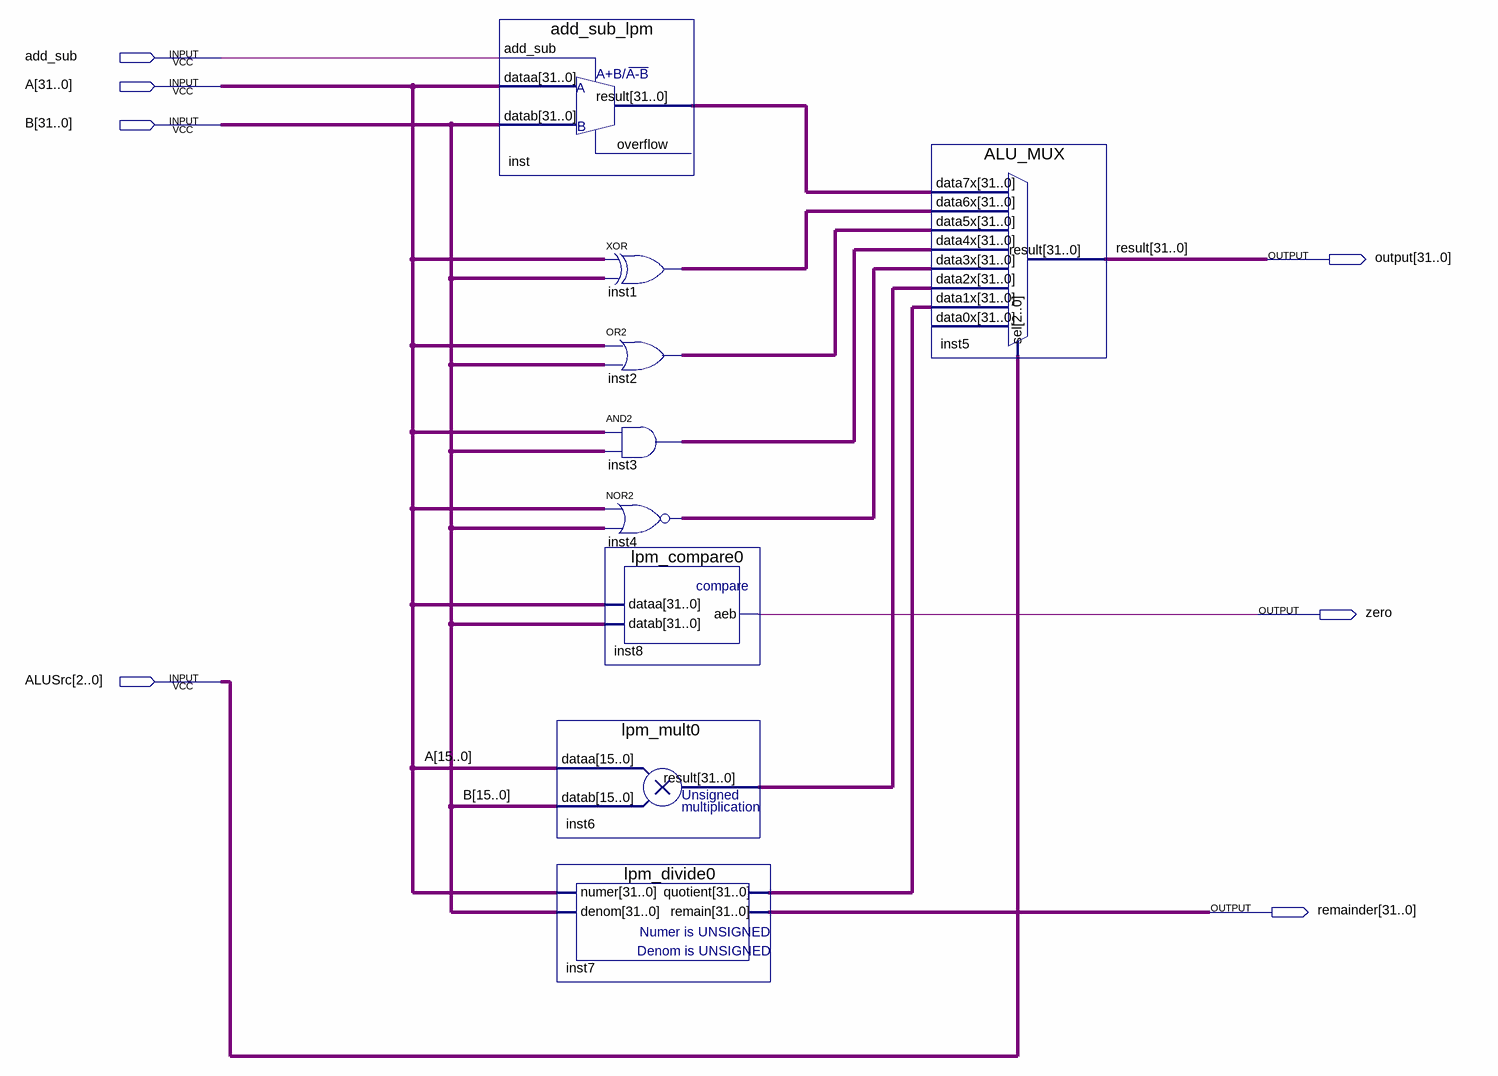
[diagram p0: schematic sheet]
// Quartus schematic ALU.bdf as structural Verilog: 9 symbols, 7 pins
module ALU (
  input  add_sub,
  input  [31:0] A,
  input  [31:0] B,
  input  [2:0] ALUSrc,
  output [31:0] \output ,
  output zero,
  output [31:0] remainder
);

  wire [31:0] inst1_out, inst2_out, inst3_out, inst4_out, inst6_result, inst7_quotient, inst_result;

  add_sub_lpm inst (.add_sub(add_sub), .dataa(A), .datab(B), .result(inst_result));  // open: overflow
  lpm_mult0 inst6 (.dataa(A[15:0]), .datab(B[15:0]), .result(inst6_result));
  lpm_divide0 inst7 (.numer(A), .denom(B), .quotient(inst7_quotient), .remain(remainder));
  assign inst1_out = A ^ B;  // XOR inst1, 32 bits wide
  assign inst2_out = A | B;  // OR2 inst2, 32 bits wide
  assign inst3_out = A & B;  // AND2 inst3, 32 bits wide
  assign inst4_out = ~(A | B);  // NOR2 inst4, 32 bits wide
  lpm_compare0 inst8 (.dataa(A), .datab(B), .aeb(zero));
  ALU_MUX inst5 (
    .data7x(inst_result), .data6x(inst1_out), .data5x(inst2_out), .data4x(inst3_out), .data3x(inst4_out),
    .data2x(inst6_result), .data1x(inst7_quotient), .sel(ALUSrc), .result(\output ));  // open: data0x

  // Other names for the same wires on the sheet: result[31:0] = \output 
endmodule
